# Altium schematic sheet M1 Design.SchDoc
size A3; SheetNumber: 1; SheetTotal: 1
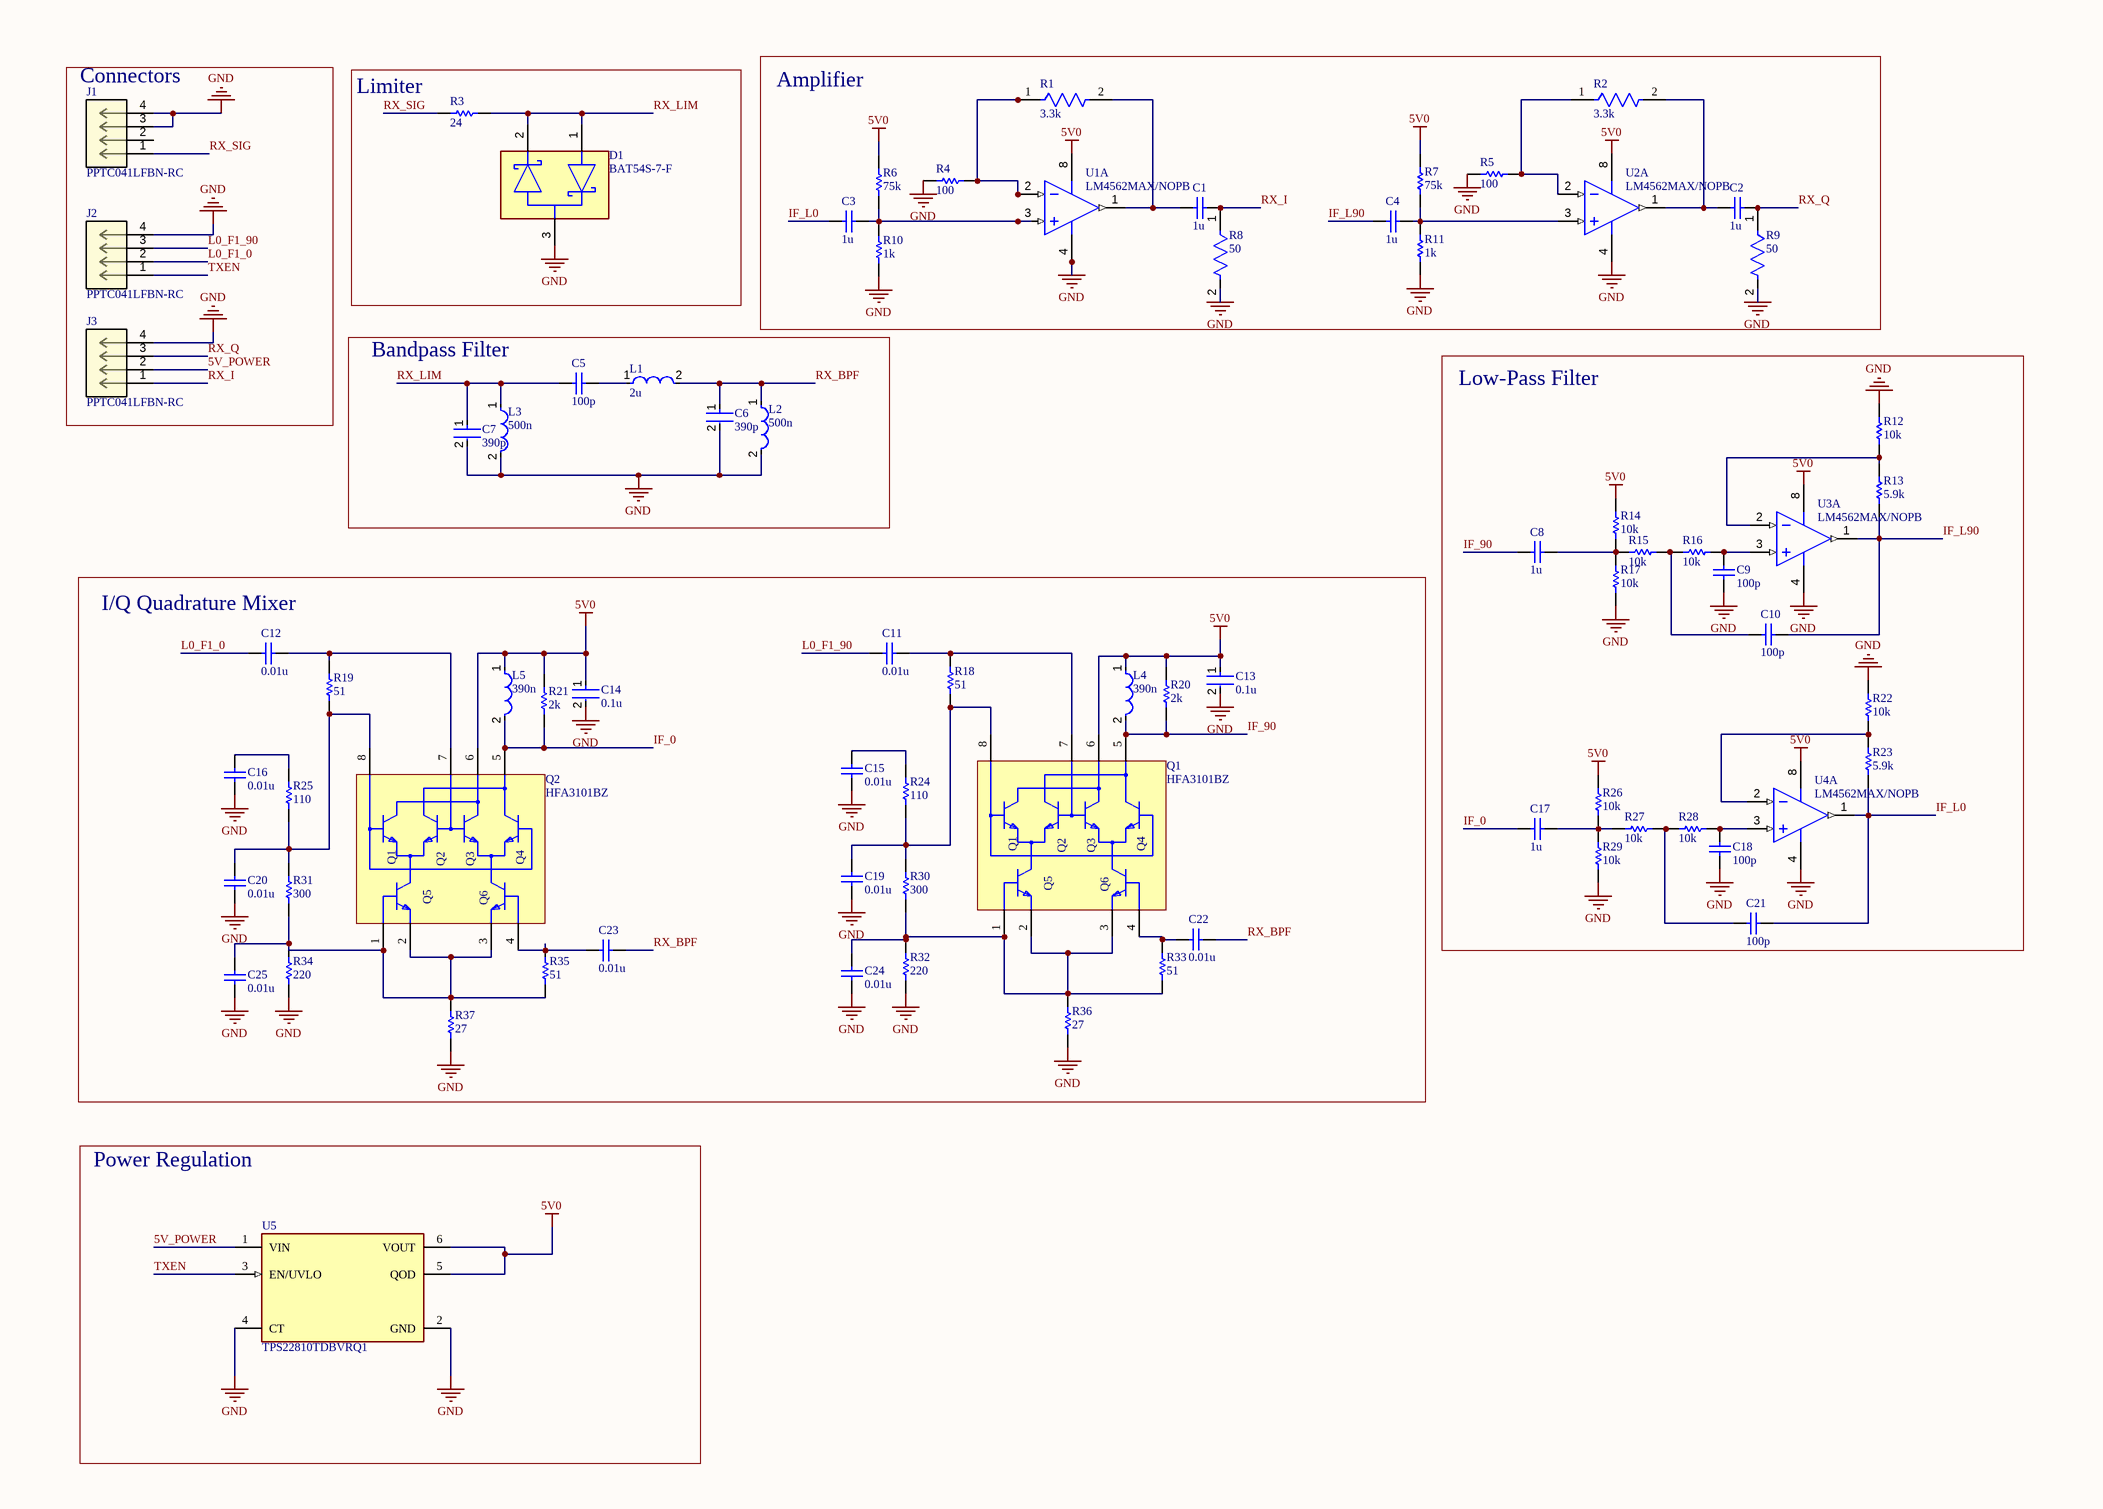
[diagram p0: M1 Design.SchDoc]

## Parts
C1  1u  [CAPC3216X110X50LL20T25]
C2  1u  [CAPC3216X110X50LL20T25]
C3  1u  [CAPC3216X110X50LL20T25]
C4  1u  [CAPC3216X110X50LL20T25]
C5  100p  [CAPC1608X90X40ML10T20]
C6  390p  [FP-GRM155-0_05-MFG]
C7  390p  [FP-GRM155-0_05-MFG]
C8  1u  [CAPC3216X110X50LL20T25]
C9  100p  [CAPC1608X90X40ML10T20]
C10  100p  [CAPC1608X90X40ML10T20]
C11  0.01u  [CAPC1005X55X25LL05T10]
C12  0.01u  [CAPC1005X55X25LL05T10]
C13  0.1u  [FP-CL17-IPC_C]
C14  0.1u  [FP-CL17-IPC_C]
C15  0.01u  [CAPC1005X55X25LL05T10]
C16  0.01u  [CAPC1005X55X25LL05T10]
C17  1u  [CAPC3216X110X50LL20T25]
C18  100p  [CAPC1608X90X40ML10T20]
C19  0.01u  [CAPC1005X55X25LL05T10]
C20  0.01u  [CAPC1005X55X25LL05T10]
C21  100p  [CAPC1608X90X40ML10T20]
C22  0.01u  [CAPC1005X55X25LL05T10]
C23  0.01u  [CAPC1005X55X25LL05T10]
C24  0.01u  [CAPC1005X55X25LL05T10]
C25  0.01u  [CAPC1005X55X25LL05T10]
D1  BAT54S-7-F  [FP-SOT23-MFG]
J1  PPTC041LFBN-RC  [CONN_PPTC041LFBN-RC_SUL]
J2  PPTC041LFBN-RC  [CONN_PPTC041LFBN-RC_SUL]
J3  PPTC041LFBN-RC  [CONN_PPTC041LFBN-RC_SUL]
L1  2u  [FP-LQW15CA_00-MFG]
L2  500n  [FP-LQW15CA_00-MFG]
L3  500n  [FP-LQW15CA_00-MFG]
L4  390n  [FP-LQW18AN_00-MFG]
L5  390n  [FP-LQW18AN_00-MFG]
Q1  HFA3101BZ  [M8_15_MFG]
Q2  HFA3101BZ  [M8_15_MFG]
R1  3.3k  [FP-ERA2A-MFG]
R2  3.3k  [FP-ERA2A-MFG]
R3  24  [RESC1005X40X25LL05T10]
R4  100  [RESC1005X40X25NL05T10]
R5  100  [RESC1005X40X25NL05T10]
R6  75k  [RESC1005X40X25NL10T10]
R7  75k  [RESC1005X40X25NL10T10]
R8  50  [FP-ALN2512-MFG]
R9  50  [FP-ALN2512-MFG]
R10  1k  [RESC1005X40X25LL05T10]
R11  1k  [RESC1005X40X25LL05T10]
R12  10k  [RESC1005X40X25LL05T10]
R13  5.9k  [RESC1608X55X30LL15T15]
R14  10k  [RESC1005X40X25LL05T10]
R15  10k  [RESC1005X40X25LL05T10]
R16  10k  [RESC1005X40X25LL05T10]
R17  10k  [RESC1005X40X25LL05T10]
R18  51  [RESC1005X40X25ML05T10]
R19  51  [RESC1005X40X25ML05T10]
R20  2k  [RESC1005X40X25LL10T10]
R21  2k  [RESC1005X40X25LL10T10]
R22  10k  [RESC1005X40X25LL05T10]
R23  5.9k  [RESC1608X55X30LL15T15]
R24  110  [RESC1005X40X25ML05T05]
R25  110  [RESC1005X40X25ML05T05]
R26  10k  [RESC1005X40X25LL05T10]
R27  10k  [RESC1005X40X25LL05T10]
R28  10k  [RESC1005X40X25LL05T10]
R29  10k  [RESC1005X40X25LL05T10]
R30  300  [RESC1608X55X25LL10T15]
R31  300  [RESC1608X55X25LL10T15]
R32  220  [RESC1005X40X25NL05T10]
R33  51  [RESC1005X40X25ML05T10]
R34  220  [RESC1005X40X25NL05T10]
R35  51  [RESC1005X40X25ML05T10]
R36  27  [RESC1005X40X25NL05T10]
R37  27  [RESC1005X40X25NL05T10]
U1  LM4562MAX/NOPB  [D0008A_N]  (part A of 2)
U2  LM4562MAX/NOPB  [D0008A_N]  (part A of 2)
U3  LM4562MAX/NOPB  [D0008A_N]  (part A of 2)
U4  LM4562MAX/NOPB  [D0008A_N]  (part A of 2)
U5  TPS22810TDBVRQ1  [FP-DBV0006A-MFG]

## Blocks framed on the sheet
Connectors: J1-J3
Limiter: D1 R3
Amplifier: C1-C4 R1 R2 R4-R11 U1 U2
Bandpass Filter: C5-C7 L1-L3
Low-Pass Filter: C8-C10 C17 C18 C21 R12-R17 R22 R23 R26-R29 U3 U4
I/Q Quadrature Mixer: C11-C16 C19 C20 C22-C25 L4 L5 Q1 Q2 R18-R21 R24 R25 R30-R37
Power Regulation: U5

## Nets
5V0: C13.1 C14.1 L4.1 L5.1 Q1.6(C1_C3) Q2.6(C1_C3) R6.2 R7.2 R14.2 R20.2 R21.2 R26.2 U1.8(V+) U2.8(V+) U3.8(V+) U4.8(V+) U5.5(QOD) U5.6(VOUT)
GND: C6.2 C7.2 C9.1 C13.2 C14.2 C15.1 C16.1 C18.1 C19.1 C20.1 C24.1 C25.1 D1.3 J1.3 J1.4 J2.4 J3.4 L2.2 L3.2 R4.1 R5.1 R8.2 R9.2 R10.1 R11.1 R12.2 R17.1 R22.2 R29.1 R32.1 R34.1 R36.1 R37.1 U1.4(V-) U2.4(V-) U3.4(V-) U4.4(V-) U5.2(GND) U5.4(CT)
5V_POWER: J3.2 U5.1(VIN)
IF_0: C17.1 L5.2 Q2.5(C2_C4) R21.1
IF_90: C8.1 L4.2 Q1.5(C2_C4) R20.1
IF_L0: C3.1 C21.2 R23.1 U4.1(OUT_A)
IF_L90: C4.1 C10.2 R13.1 U3.1(OUT_A)
L0_F1_0: C12.1 J2.2
L0_F1_90: C11.1 J2.3
RX_BPF: C6.1 C22.1 C23.1 L1.2 L2.1
RX_I: C1.2 J3.1 R8.1
RX_LIM: C5.1 C7.1 D1.1 D1.2 L3.1 R3.2
RX_Q: C2.2 J3.3 R9.1
RX_SIG: J1.1 R3.1
TXEN: J2.1 U5.3(EN/UVLO)
NetC1_1: C1.1 R1.2 U1.1(OUT_A)
NetC2_1: C2.1 R2.2 U2.1(OUT_A)
NetC3_2: C3.2 R6.1 R10.2 U1.3(IN_A)
NetC4_2: C4.2 R7.1 R11.2 U2.3(IN_A)
NetC5_2: C5.2 L1.1
NetC8_2: C8.2 R14.1 R15.2 R17.2
NetC9_2: C9.2 R16.1 U3.3(IN_A)
NetC10_1: C10.1 R15.1 R16.2
NetC11_2: C11.2 Q1.7(B2_B3) R18.2
NetC12_2: C12.2 Q2.7(B2_B3) R19.2
NetC15_2: C15.2 R24.2
NetC16_2: C16.2 R25.2
NetC17_2: C17.2 R26.1 R27.2 R29.2
NetC18_2: C18.2 R28.1 U4.3(IN_A)
NetC19_2: C19.2 Q1.8(B1_B4) R18.1 R24.1 R30.2
NetC20_2: C20.2 Q2.8(B1_B4) R19.1 R25.1 R31.2
NetC21_1: C21.1 R27.1 R28.2
NetC22_2: C22.2 Q1.4(B6) R33.2
NetC23_2: C23.2 Q2.4(B6) R35.2
NetC24_2: C24.2 Q1.1(B5) Q1.2(E5) Q1.3(E6) R30.1 R32.2 R33.1 R36.2
NetC25_2: C25.2 Q2.1(B5) Q2.2(E5) Q2.3(E6) R31.1 R34.2 R35.1 R37.2
NetR1_1: R1.1 R4.2 U1.2(IN_A)
NetR2_1: R2.1 R5.2 U2.2(IN_A)
NetR12_1: R12.1 R13.2 U3.2(IN_A)
NetR22_1: R22.1 R23.2 U4.2(IN_A)

Not connected (* = marked no-connect by the designer): J1 2

## Notes on the sheet
- DWG. NO.
- REV.
- SHT.
- THIS DOCUMENT AND THE DATA DISCLOSED HEREIN OR HEREWITH IS THE PROPERTY OF ALTIUM LIMITED AND MAY BE FREELY DISTRIBUTED IN WHOLE. NO RIGHTS ARE RESERVED OR EXPRESS OR IMPLIED WARANTEE GIVEN.
- REVISION
- DESCRIPTION
- DATE
- APPROVED
- ENG:
- APPROVALS
- PROJECT
- DSN:
- CHK:
- REFERENCE DOCUMENTS
- PROJECT REVISION:
- TITLE
- DOCUMENT REVISION:
- DESIGN ITEM:
- BOM:
- FAB DWG:
- PCB DWG:
- ASSY DWG:
- SCALE:
- SIZE
- B
- CAGE CODE
- FILE NAME
- DWG NO.
- SHEET
- OF
- REV
- (in symbol CMP-00572-88252381-1) Q1; Q4; Q3; Q5; Q6; Q2

## Library data of the parts
C1-C4 C8 C17 = CMP-2000-06011-1: Chip Capacitor, 1 uF, +/- 10%, 50 V, -55 to 125 degC, 1206 (3216 Metric), RoHS, Tape and Reel; Manufacturer: Kemet; Case Height: 1mm; Dielectric: X7R; Voltage Rating: 50V; Capacitance: 1uF; Temperature Coefficient / Code: +/-15%; Case Length: 3.2mm; Case Width: 1.6mm; Type: SMDMLCCX7R6.3-250VDCCommericalGrade; Class: Class1; Capacitance - nF: 1000nF; Datasheet URL: http://www.kemet.com/docfinder?Partnumber=C1206C105K5RACTU; Product Category: MultilayerCeramicCapacitorsMLCC-SMD/SMT; Termination Style: SMD/SMT; Dimensions: 1.6mmWx3.2mmLx1mmH; Voltage Rating DC: 50V; Datasheet Version: 02/2016; Packaging: Reel; Brand: Kemet; RoHS: Details; Minimum Operating Temperature: -55C; Operating Temperature Range: -55Cto+125C; Package Reference: 1206; Manufacturer URL: http://www.kemet.com/; Product: GeneralTypeMLCCs; Tolerance: 10%; Package Description: 2-Pin Surface Mount Device, Body 3.2 x 1.6 mm; Mounting Technology: SurfaceMount; Case Code - mm: 3216; Maximum Operating Temperature: +125C; Series: C1206C; Factory Pack Quantity: 2500; Package / Case: 1206(3216metric); Case Code - in: 1206
C5 C9 C10 C18 C21 = CMP-2100-03594-1: Chip Capacitor, 100 pF, +/- 5%, 50 V, -55 to 125 degC, 0603 (1608 Metric), RoHS, Tape and Reel; Manufacturer: Yageo; Capacitance: 100pF; Voltage Rating (DC): 50V; Dielectric: C0G; Temperature Coefficient: 30ppm/degC; Insulation Resistance: 100GR; Datasheet Version: Rev. 14, 07/2016; Manufacturer URL: http://www.yageo.com/; Packaging: TapeandReel; Mount: SurfaceMount; RoHSCompliant: True; Package Reference: 0603; Tolerance: 5%; Max Operating Temperature: 125degC; Case Code (Imperial): 0603; Number of Pins: 2; Width: 0.8mm; Case Code (Metric): 1608; Voltage: 50V; REACH SVHC: Unknown; Package Description: 2-Pin Surface Mount Device, Body 1.6 x 0.8 mm; Composition: Ceramic; Lead Free: LeadFree; Min Operating Temperature: -55degC; Radiation Hardening: No; Depth: 0.8mm; Thickness: 0.035inch; Datasheet URL: http://www.yageo.com/documents/recent/UPY-GP_NP0_16V-to-50V_14.pdf; Termination: SMD/SMT; Package Quantity: 1; Length: 1.6mm; Voltage Rating: 50V; Height: 0.8mm; Case/Package: 0603
C6 C7 = CMP-2008-04345-2: Chip Multilayer Ceramic Capacitors for General Purpose, 0402, 390pF, C0G, 30ppm/°C, 5%, 50V; REACH SVHC: No SVHC; Case Code (Metric): 1005; Thickness: 0.022inch; Lead Free: Lead Free; Case/Package: 0402; Min Operating Temperature: -55°C; Mount: Surface Mount; Length: 1mm; Depth: 0.5mm; Package Quantity: 1; Tolerance: 5%; Case Code (Imperial): 0402; Temperature Coefficient: 30ppm/°C; Packaging: Tape and Reel; Voltage Rating (DC): 50V; Material: Ceramic; Voltage Rating: 50V; Max Operating Temperature: 125°C; Voltage: 50V; Radiation Hardening: No; Capacitance: 390pF; Termination: SMD/SMT; Height: 0.5mm; Dielectric: C0G; Width: 0.02inch
C11 C12 C15 C16 C19 C20 C22-C25 = CMP-2000-06332-1: Chip Capacitor, 10 nF, 16 V, 10%, -55 to 125 degC, 0402 (1005 Metric), RoHS, Tape and Reel; Manufacturer: Murata; Rated Voltage: 16V; Capacitance: 10000pF; Dielectric: X7R; Manufacturer URL: http://www.murata.com/; Package Description: 2-Pin Surface Mount Device, Body 1 x 0.5 mm; Case Size/Dimension: 0402; Tolerance (%): ±10%; Datasheet Version: 06/2016; Package Reference: 0402; Mounting Technology: SurfaceMount; Datasheet URL: http://psearch.en.murata.com/capacitor/product/GRM155R71C103KA01%23.pdf
C13 C14 = CMP-13271-001069-1: Cap Ceramic 100nF 10V X7R ±10% SMD 0402 +125°C Paper T/R; Height: 0.5mm; Case/Package: 0402; Contact Plating: Tin; Case Code (Imperial): 0402; Capacitance: 100nF; Thickness: 0.022inch; Min Operating Temperature: -55°C; Package Quantity: 1; Length: 1mm; Max Operating Temperature: 125°C; Depth: 0.5mm; Voltage Rating: 10V; Packaging: Tape and Reel; Mount: Surface Mount; Tolerance: 10%; Width: 0.02inch; Radiation Hardening: No; Case Code (Metric): 1005; Dielectric: X7R
D1 = CMP-1667-00006-2: DIODE ARRAY SCHOTTKY 30V SOT23-3; Forward Voltage: 800mV; Reverse Recovery Time: 5ns; Peak Non-Repetitive Surge Current: 600mA; Power Rating: 200mW; Current Rating: 200mA; Peak Reverse Current: 2uA; Capacitance: 10pF; Width: 1.3mm; Mount: Surface Mount; Height: 1mm; Number of Pins: 3; Weight: 0.000282oz; Max Reverse Voltage (DC): 30V; Max Power Dissipation: 200mW; Lead Free: Lead Free; Max Operating Temperature: 150°C; Min Operating Temperature: -65°C; Package Quantity: 3000; REACH SVHC: No SVHC; Termination: SMD/SMT; Max Forward Surge Current (Ifsm): 600mA; Radiation Hardening: No; Voltage Rating (DC): 30V; Average Rectified Current: 200mA; Max Repetitive Reverse Voltage (Vrrm): 30V; Contact Plating: Tin; Case/Package: SOT-23; Forward Current: 200mA; Power Dissipation: 200mW; Length: 2.9mm; Packaging: Tape and Reel
J1-J3 = PPTC041LFBN-RC: No Description Available; Mfr_Name: Sullins; RefDes: RefDes; Type: Type
L1 = CMP-06042-013572-1: Wire Wound Ferrite Inductor for General Circuits 2000nH ±10% 130mA 3.2Ω 0402 (1005); Inductance: 2uH; DC Resistance (DCR): 3.2R; Shielding: Unshielded; Self Resonant Frequency: 120MHz; Test Frequency: 10MHz; Current Rating: 130mA; Mount: Surface Mount; Width: 0.022inch; Max Operating Temperature: 125°C; Length: 0.04inch; Case/Package: Nonstandard; Height - Seated (Max): 0.026inch; Resistor Type: Wirewound; Core Material: Ferrite; Tolerance: 10%; Packaging: Tape and Reel; Min Operating Temperature: -40°C
L2 L3 = CMP-06042-006025-1: Wire Wound Ferrite Inductor for General Circuits 500nH ±5% 270mA 0.97Ω 0402 (1005); Self Resonant Frequency: 900MHz; DC Resistance (DCR): 970mR; Test Frequency: 10MHz; Shielding: Unshielded; Mount: Surface Mount; Tolerance: 5%; Length: 0.04inch; Inductance: 500nH; Core Material: Ferrite; Packaging: Cut Tape; Max Operating Temperature: 125°C; Height - Seated (Max): 0.026inch; Current Rating: 270mA; Width: 0.022inch; Case/Package: Nonstandard; Min Operating Temperature: -40°C; Resistor Type: Wirewound
L4 L5 = CMP-06042-005178-1: Wire Wound RF Inductor 390nH ±5% 80mA 6.2Ω 0603 (1608); Core Material: Non-Magnetic; Test Frequency: 100MHz; DC Resistance (DCR): 6.2R; Q Factor: 30; Shielding: Unshielded; Self Resonant Frequency: 800MHz; Height: 0.8mm; DC Current: 80mA; Termination: SMD/SMT; Package Quantity: 4000; Case Code (Imperial): 0603; Depth: 1mm; Max Operating Temperature: 125°C; Packaging: Tape and Reel; Length: 1.6mm; Height - Seated (Max): 0.039inch; Width: 0.031inch; Case Code (Metric): 1608; Case/Package: 0603; Min Operating Temperature: -55°C; Inductance: 390nH; Resistor Type: Wirewound; Military Standard: Not; Tolerance: 5%; Weight: 0.000106oz; Mount: Surface Mount; Current Rating: 80mA; Lead Free: Lead Free; Max DC Current: 80mA; Radiation Hardening: No
Q1 Q2 = CMP-00572-88252381-1: HFA3096 Series NPN 12 Vce 10 Ghz UHF Transistor Array - SOIC-8; Manufacturer Lifecycle Status: ACTIVE; Transition Frequency: 10GHz; Collector Emitter Voltage (VCEO): 8V; Noise Figure: 3.5dB; Collector Base Voltage (VCBO): 12V; Current Rating: 30mA; Emitter Base Voltage (VEBO): 5.5V; Pitch: 1.3mm; Bandwidth: 900MHz; Gain Bandwidth Product: 10GHz; ComponentLink3Description: Manufacturer's Package Drawing; Schedule B: 8542330000; Collector Emitter Breakdown Voltage: 8V; RoHS: Compliant; Lead Free: Lead Free; ComponentLink1URL: http://www.renesas.com; Lifecycle Status: Production; Voltage Rating (DC): 8V; Contact Plating: Tin; Packaging: Bulk; ComponentLink2URL: https://octopart.com/cad-content/api/get-model-datasheet/15189/88252381; ComponentLink3URL: https://www.renesas.com/en/document/psc/m815-8-lead-narrow-body-small-outline-plastic-package; ComponentLink2Description: Datasheet URL; Max Frequency: 10GHz; Max Operating Temperature: 85°C; HelpURL: https://octopart.com/cad-content/api/get-model-datasheet/15189/88252381; Min Operating Temperature: -40°C; Height: 0m; Radiation Hardening: No; Continuous Collector Current: 30mA; Polarity: NPN; Mount: Surface Mount; Case/Package: SOIC; Number of Pins: 8; Max Collector Current: 30mA; Length: 4.9mm; REACH SVHC: No SVHC; ComponentLink1Description: Manufacturer's Website; Width: 3.9mm
R1 R2 = CMP-2002-05884-2: NexarPartId: 9251384; Voltage Rating (DC): 25V; Temperature Coefficient: 25ppm/°C; Tolerance: 0.1%; Resistance: 3.3kΩ; Power Rating: 63mW; Case/Package: 0402; Number of Terminations: 2; Military Standard: Not; Case Code (Imperial): 0402; Length: 1mm; Contact Plating: Tin; Termination: SMD/SMT; Schedule B: 8533210045, 8533210045; Voltage Rating: 25V; Lead Free: Lead Free; Min Operating Temperature: -55°C; REACH SVHC: No SVHC; Max Power Dissipation: 63mW; Weight: 793.786648µg; RoHS: Compliant; Depth: 500µm; Packaging: Cut Tape; Max Operating Temperature: 155°C; Width: 500µm; Case Code (Metric): 1005; Height: 350µm; Composition: Thin Film; Lifecycle Status: Production; Radiation Hardening: No; Number of Pins: 2; Mount: Surface Mount
R3 = CMP-1011-00035-2: Part Number: RC0402JR-0724RL; Manufacturer: Yageo
R4 R5 = CMP-2002-07914-1: Part Number: RC0402JR-07100RL; Manufacturer: Yageo / Phycomp
R6 R7 = CMP-2002-05825-1: Part Number: ERA-2AEB753X; Manufacturer: Panasonic
R8 R9 = CMP-33361-000037-1: 2512 CHIP ALNI 50 OHMS 1%; RoHS Compliant: Yes
R10 R11 = CMP-2002-07941-1: Part Number: RC0402JR-071KL; Manufacturer: Yageo / Phycomp
R12 R14-R17 R22 R26-R29 = CMP-2002-07353-1: Part Number: RC0402FR-0710KL; Manufacturer: Yageo / Phycomp
R13 R23 = CMP-2000-00580-1: Part Number: ERJ-3EKF5901V; Manufacturer: Panasonic
R18 R19 R33 R35 = CMP-2002-08019-1: Manufacturer: Yageo / Phycomp; Part Number: RC0402JR-0751RL
R20 R21 = CMP-2002-05790-1: Manufacturer: Panasonic; Part Number: ERA-2AEB202X
R24 R25 = CMP-2002-00438-1: Manufacturer: Panasonic; Part Number: ERJ-2GEJ111X
R30 R31 = CMP-2000-06958-1: Chip Resistor, 330 Ohm, +/- 5%, 50 V, -55 to 155 degC, 0603 (1608 Metric), -40 to 155 degC, RoHS, Tape and Reel; Manufacturer: Yageo; Temperature Coefficient: ±100ppm/°C; Power Rating: 100mW; Voltage Rating: 50V; Product Range: RCSeries; SVHC: ToBeAdvised; Resistance: 330ohm; Resistor Element Type: ThickFilm; Resistor Case Style: 0603[1608Metric]; Manufacturer URL: http://www.yageo.com/; Packaging: CutTape; Mounting Technology: SurfaceMount; Automotive Qualification Standard: -; MSL: MSL1-Unlimited; Datasheet URL: http://www.yageo.com/documents/recent/PYu-RC_Group_51_RoHS_L_7.pdf; Package Reference: 0603; Package Description: 2-Pin Surface Mount Device, Body 1.6 x 0.8 mm; Resistance Tolerance: ±5%; Datasheet Version: Rev. 7, 05/2017
R32 R34 = CMP-2002-07959-1: Manufacturer: Yageo / Phycomp; Part Number: RC0402JR-07220RL
R36 R37 = CMP-1011-00036-2: Part Number: RC0402JR-0727RL; Manufacturer: Yageo / Phycomp
U1-U4 = CMP-0057-00397-3: Dual High Performance, High Fidelity Audio Operational Amplifier, 8-pin Narrow SOIC, Pb-Free; Manufacturer: Texas Instruments; CompType: Audio IC; PowerWise: Y; PackageTopMarking: NSZXTT*L4562*MA; PackageDescription: SOIC Narrow, 4.9 x 3.9 x 1.45mm, 8 Lead, 1.27mm Pitch; Code_IPC: SOIC127P600-8; ComponentLink1URL: http://www.ti.com/general/docs/lit/getliterature.tsp?genericPartNumber=LM4562&fileType=pdf; RoHS: Y; PackageReference: D0008A; ComponentLink1Description: Datasheet URL; Code_JEDEC: MS-012-AA; PinCount: 8
U5 = CMP-04910-000007-2: IC PWR SWITCH N-CHAN 1:1 SOT23-6; Max Output Current: 2A; Max Supply Voltage: 18V; Min Supply Voltage: 2.7V; Number of Outputs: 1; Output Configuration: High Side; Fault Protection: Over Temperature; Interface: On/Off; Weight: 0.000801oz; Case/Package: SOT-23-6; Series: TPS22810-Q1; Package Quantity: 3000; RoHS Compliant: Yes; Number of Channels: 1; Max Operating Temperature: 105°C; Packaging: Cut Tape; Min Operating Temperature: -40°C